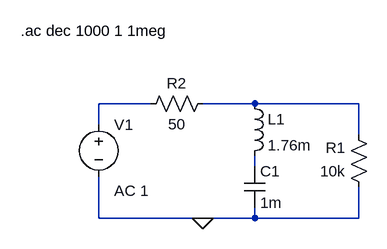
[diagram p0: schematic notch_filter.asc]
notch_filter.asc, the LTspice schematic file:
Version 4
SHEET 1 880 680
WIRE 272 240 192 240
WIRE 432 240 352 240
WIRE 592 240 432 240
WIRE 192 272 192 240
WIRE 592 288 592 240
WIRE 432 336 432 320
WIRE 192 416 192 352
WIRE 352 416 192 416
WIRE 432 416 432 400
WIRE 432 416 352 416
WIRE 592 416 592 368
WIRE 592 416 432 416
FLAG 352 416 0
SYMBOL voltage 192 256 R0
WINDOW 123 24 118 Left 2
SYMATTR InstName V1
SYMATTR Value ""
SYMATTR Value2 AC 1
SYMBOL res 608 384 R180
WINDOW 0 36 76 Left 2
WINDOW 3 36 40 Left 2
SYMATTR InstName R1
SYMATTR Value 10k
SYMBOL cap 416 336 R0
SYMATTR InstName C1
SYMATTR Value 1m
SYMBOL ind 416 224 R0
SYMATTR InstName L1
SYMATTR Value 1.76m
SYMBOL res 368 224 R90
WINDOW 0 0 56 VBottom 2
WINDOW 3 32 56 VTop 2
SYMATTR InstName R2
SYMATTR Value 50
TEXT 72 128 Left 2 !.ac dec 1000 1 1meg

The netlist it stands for:
* notch_filter.asc
V1 N001 0 AC 1
R1 0 N002 10k
C1 N003 0 1m
L1 N002 N003 1.76m
R2 N002 N001 50
.ac dec 1000 1 1meg
.backanno
.end